# Altium schematic sheet JFETSOT23_DCBias.SchDoc
size A4
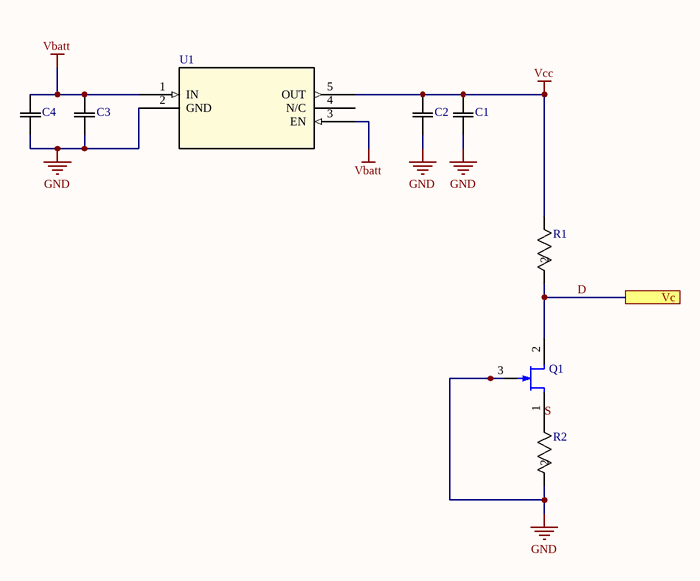
[diagram p0: JFETSOT23_DCBias.SchDoc]

## Parts
C1  (no value)  [YAG_CC0402]
C2  (no value)  [YAG_CC0402]
C3  (no value)  [YAG_CC0402]
C4  (no value)  [YAG_CC0402]
Q1  (no value)  [ONSC-CP-3-318AN_A_V]
R1  (no value)  [RC0402N]
R2  (no value)  [RC0402N]
U1  (no value)  [DBV5]

## Ports
Vc

## Nets
GND: C1.1 C2.1 C3.1 C4.1 Q1.3(G) R2.2 U1.2(GND)
Vbatt: C3.2 C4.2 U1.1(IN) U1.3(EN)
Vcc: C1.2 C2.2 R1.1 U1.5(OUT)
D: Q1.2(D) R1.2 ; port Vc
S: Q1.1(S) R2.1

Not connected (* = marked no-connect by the designer): U1 4(N/C)

## Library data of the parts
C1-C4 = CC0402KRX7R9BB10: No Description Available; Manufacturer_Part_Number: CC0402KRX7R9BB103; Vendor: Yageo; Built_By: EMA_UL_Team; Type: DEV; Copyright: Copyright (C) 2018 Accelerated Designs. All rights reserved; RefDes: RefDes; Value: Value
Q1 = 2SK2394-6-TB-E: N-Channel JFET, 15 V, 10 to 20 mA, 38 mS, 3-Pin CP, Pb-Free, Tape and Reel; Manufacturer: On Semiconductor; Channel Polarity: N Channel; IDSS Max (uA): 20000; IDSS Min (uA): 10000; PackageReference: CP-3-318AN_A; PackageDescription: 3-Pin Small Outline Transistor, Body 2.9 x 1.5 mm, Pitch 0.95 mm; Supplier 1: Digi-Key; Supplier Part Number 1: 2SK2394-6-TB-E-ND; Supplier 2: Mouser; Supplier Part Number 2: 863-2SK2394-6-TB-E; Packing: Tape and Reel; RoHS: Pb-Free; Mounting Technology: Surface Mount; PartNumber: 2SK2394-6-TB-E; ComponentLink1Description: Manufacturer URL; ComponentLink1URL: http://www.onsemi.com/; ComponentLink2Description: Datasheet; ComponentLink2URL: http://www.onsemi.com/pub_link/Collateral/EN4839-D.PDF; ComponentLink3Description: Package Specification; ComponentLink3URL: http://www.onsemi.com/pub_link/Collateral/EN6619-D.PDF
R1 R2 = RC0402JR-070RL: No Description Available; Vendor: Yageo; Built_By: EMA_UL_Team; Manufacturer_Part_Number: RC0402JR-070RL; Copyright: Copyright (C) 2018 Accelerated Designs. All rights reserved; RefDes: RefDes; Type: DEV; Value: Value
U1 = LP5907MFX-3.3/NO: No Description Available; Manufacturer_Part_Number: LP5907MFX-3.3/NOPB; Vendor: Texas Instruments; Built_By: EMA_UL_Team; Copyright: Copyright (C) 2018 Accelerated Designs. All rights reserved; RefDes: RefDes; Type: DEV; Value: Value